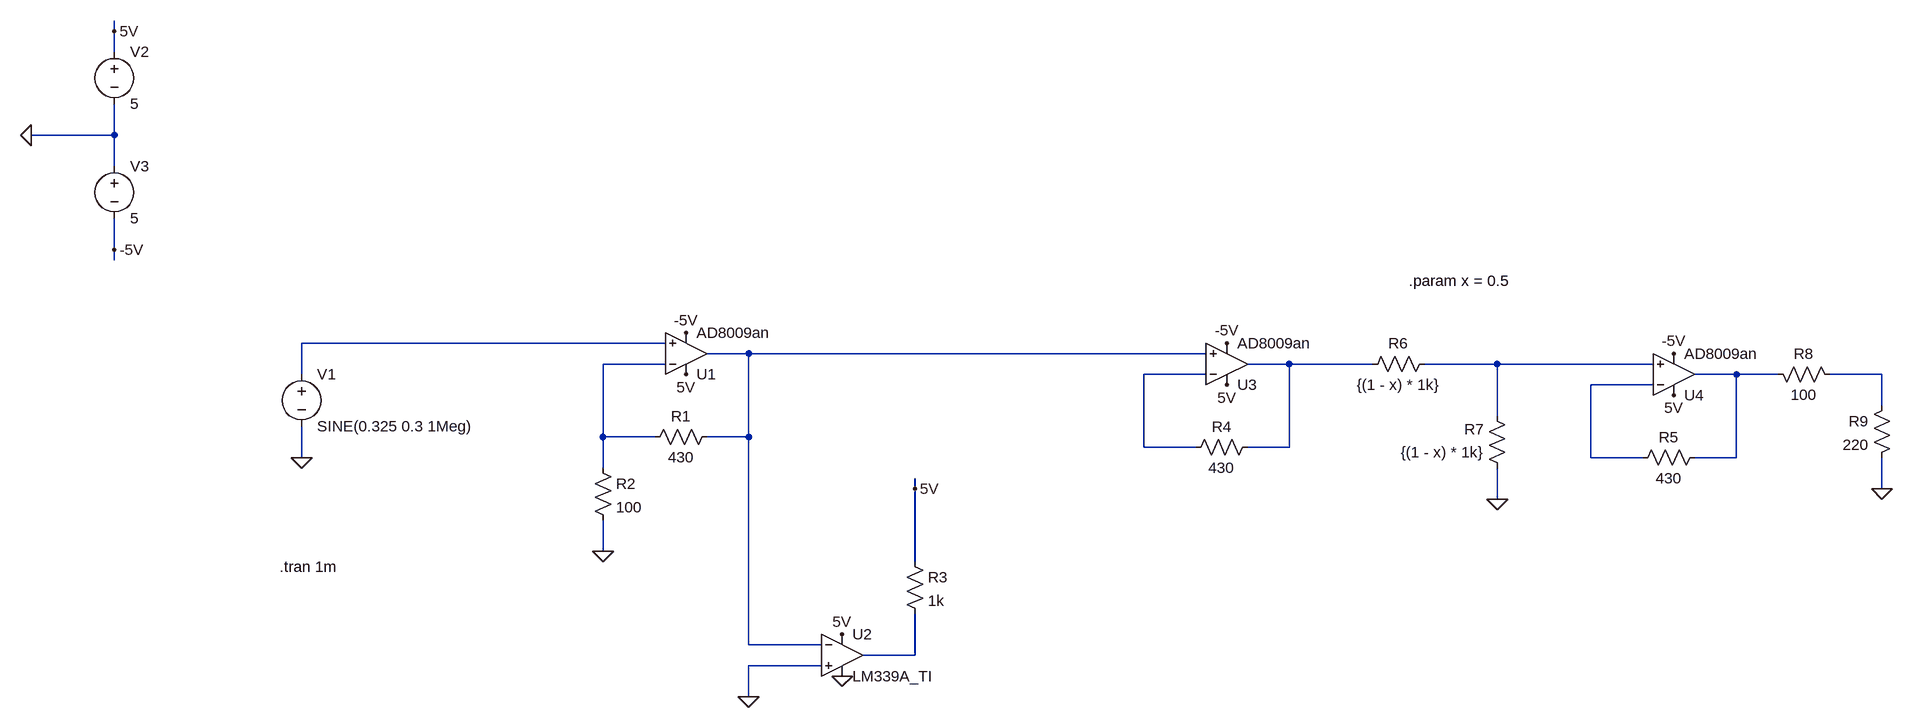
[diagram p0: schematic 101_amp.asc]
101_amp.asc, the LTspice schematic file:
Version 4
SHEET 1 2308 680
WIRE -592 -736 -592 -752
WIRE -592 -704 -592 -736
WIRE -592 -576 -592 -624
WIRE -592 -576 -720 -576
WIRE -592 -528 -592 -576
WIRE -592 -400 -592 -448
WIRE -592 -384 -592 -400
WIRE 256 -256 -304 -256
WIRE 384 -240 320 -240
WIRE 1088 -240 384 -240
WIRE 256 -224 160 -224
WIRE 1216 -224 1152 -224
WIRE 1344 -224 1216 -224
WIRE 1536 -224 1424 -224
WIRE 1776 -224 1536 -224
WIRE -304 -208 -304 -256
WIRE 1088 -208 992 -208
WIRE 1904 -208 1840 -208
WIRE 1968 -208 1904 -208
WIRE 2128 -208 2048 -208
WIRE 1776 -192 1680 -192
WIRE 2128 -160 2128 -208
WIRE 1536 -144 1536 -224
WIRE 160 -112 160 -224
WIRE 240 -112 160 -112
WIRE 384 -112 384 -240
WIRE 384 -112 320 -112
WIRE 992 -96 992 -208
WIRE 1072 -96 992 -96
WIRE 1216 -96 1216 -224
WIRE 1216 -96 1152 -96
WIRE -304 -80 -304 -128
WIRE 1680 -80 1680 -192
WIRE 1760 -80 1680 -80
WIRE 1904 -80 1904 -208
WIRE 1904 -80 1840 -80
WIRE 160 -64 160 -112
WIRE 640 -32 640 -48
WIRE 2128 -32 2128 -80
WIRE 1536 -16 1536 -64
WIRE 160 64 160 16
WIRE 640 80 640 -32
WIRE 384 208 384 -112
WIRE 496 208 384 208
WIRE 640 224 640 160
WIRE 640 224 560 224
WIRE 496 240 384 240
WIRE 384 288 384 240
FLAG 288 -208 5V
FLAG 528 192 5V
FLAG 288 -272 -5V
FLAG 160 64 0
FLAG -304 -80 0
FLAG 384 288 0
FLAG 640 -32 5V
FLAG -720 -576 0
FLAG -592 -400 -5V
FLAG -592 -736 5V
FLAG 1120 -192 5V
FLAG 1120 -256 -5V
FLAG 528 256 0
FLAG 1808 -176 5V
FLAG 1808 -240 -5V
FLAG 1536 -16 0
FLAG 2128 -32 0
SYMBOL ZZZ\\OpAmp\\AD8009an 288 -240 M180
SYMATTR InstName U1
SYMBOL ZZZ\\Comparator\\LM339A_TI 528 224 R0
SYMATTR InstName U2
SYMBOL res 336 -128 R90
WINDOW 0 0 56 VBottom 2
WINDOW 3 32 56 VTop 2
SYMATTR InstName R1
SYMATTR Value 430
SYMBOL res 144 -80 R0
SYMATTR InstName R2
SYMATTR Value 100
SYMBOL voltage -304 -224 R0
WINDOW 123 0 0 Left 0
WINDOW 39 0 0 Left 0
SYMATTR InstName V1
SYMATTR Value SINE(0.325 0.3 1Meg)
SYMBOL res 624 64 R0
SYMATTR InstName R3
SYMATTR Value 1k
SYMBOL voltage -592 -720 R0
WINDOW 123 0 0 Left 0
WINDOW 39 0 0 Left 0
SYMATTR InstName V2
SYMATTR Value 5
SYMBOL voltage -592 -544 R0
WINDOW 123 0 0 Left 0
WINDOW 39 0 0 Left 0
SYMATTR InstName V3
SYMATTR Value 5
SYMBOL ZZZ\\OpAmp\\AD8009an 1120 -224 M180
SYMATTR InstName U3
SYMBOL res 1168 -112 R90
WINDOW 0 0 56 VBottom 2
WINDOW 3 32 56 VTop 2
SYMATTR InstName R4
SYMATTR Value 430
SYMBOL ZZZ\\OpAmp\\AD8009an 1808 -208 M180
SYMATTR InstName U4
SYMBOL res 1856 -96 R90
WINDOW 0 0 56 VBottom 2
WINDOW 3 32 56 VTop 2
SYMATTR InstName R5
SYMATTR Value 430
SYMBOL res 1440 -240 R90
WINDOW 0 0 56 VBottom 2
WINDOW 3 32 56 VTop 2
SYMATTR InstName R6
SYMATTR Value {(1 - x) * 1k}
SYMBOL res 1552 -48 R180
WINDOW 0 36 76 Left 2
WINDOW 3 36 40 Left 2
SYMATTR InstName R7
SYMATTR Value {(1 - x) * 1k}
SYMBOL res 1952 -224 M90
WINDOW 0 0 56 VBottom 2
WINDOW 3 32 56 VTop 2
SYMATTR InstName R8
SYMATTR Value 100
SYMBOL res 2144 -176 M0
SYMATTR InstName R9
SYMATTR Value 220
TEXT -338 88 Left 2 !.tran 1m
TEXT 1400 -352 Left 2 !.param x = 0.5

The netlist it stands for:
* 101_amp.asc
* U1: AD8009an (symbol ZZZ\OpAmp\AD8009an not available, pins judged from their places): In+=N001 In-=N003 V+=5V V-=-5V OUT=N002
* U2: LM339A_TI (symbol ZZZ\Comparator\LM339A_TI not available, pins judged from their places): In+=0 In-=N002 V+=5V V-=0 OUT=N010
R1 N002 N003 430
R2 N003 0 100
V1 N001 0 SINE(0.325 0.3 1Meg)
R3 5V N010 1k
V2 5V 0 5
V3 0 -5V 5
* U3: AD8009an (symbol ZZZ\OpAmp\AD8009an not available, pins judged from their places): In+=N002 In-=N006 V+=5V V-=-5V OUT=N004
R4 N004 N006 430
* U4: AD8009an (symbol ZZZ\OpAmp\AD8009an not available, pins judged from their places): In+=N005 In-=N009 V+=5V V-=-5V OUT=N007
R5 N007 N009 430
R6 N005 N004 {(1 - x) * 1k}
R7 0 N005 {(1 - x) * 1k}
R8 N007 N008 100
R9 N008 0 220
.tran 1m
.param x = 0.5
.backanno
.end